# EAGLE design trackuino-shield (EAGLE 6.5.0)
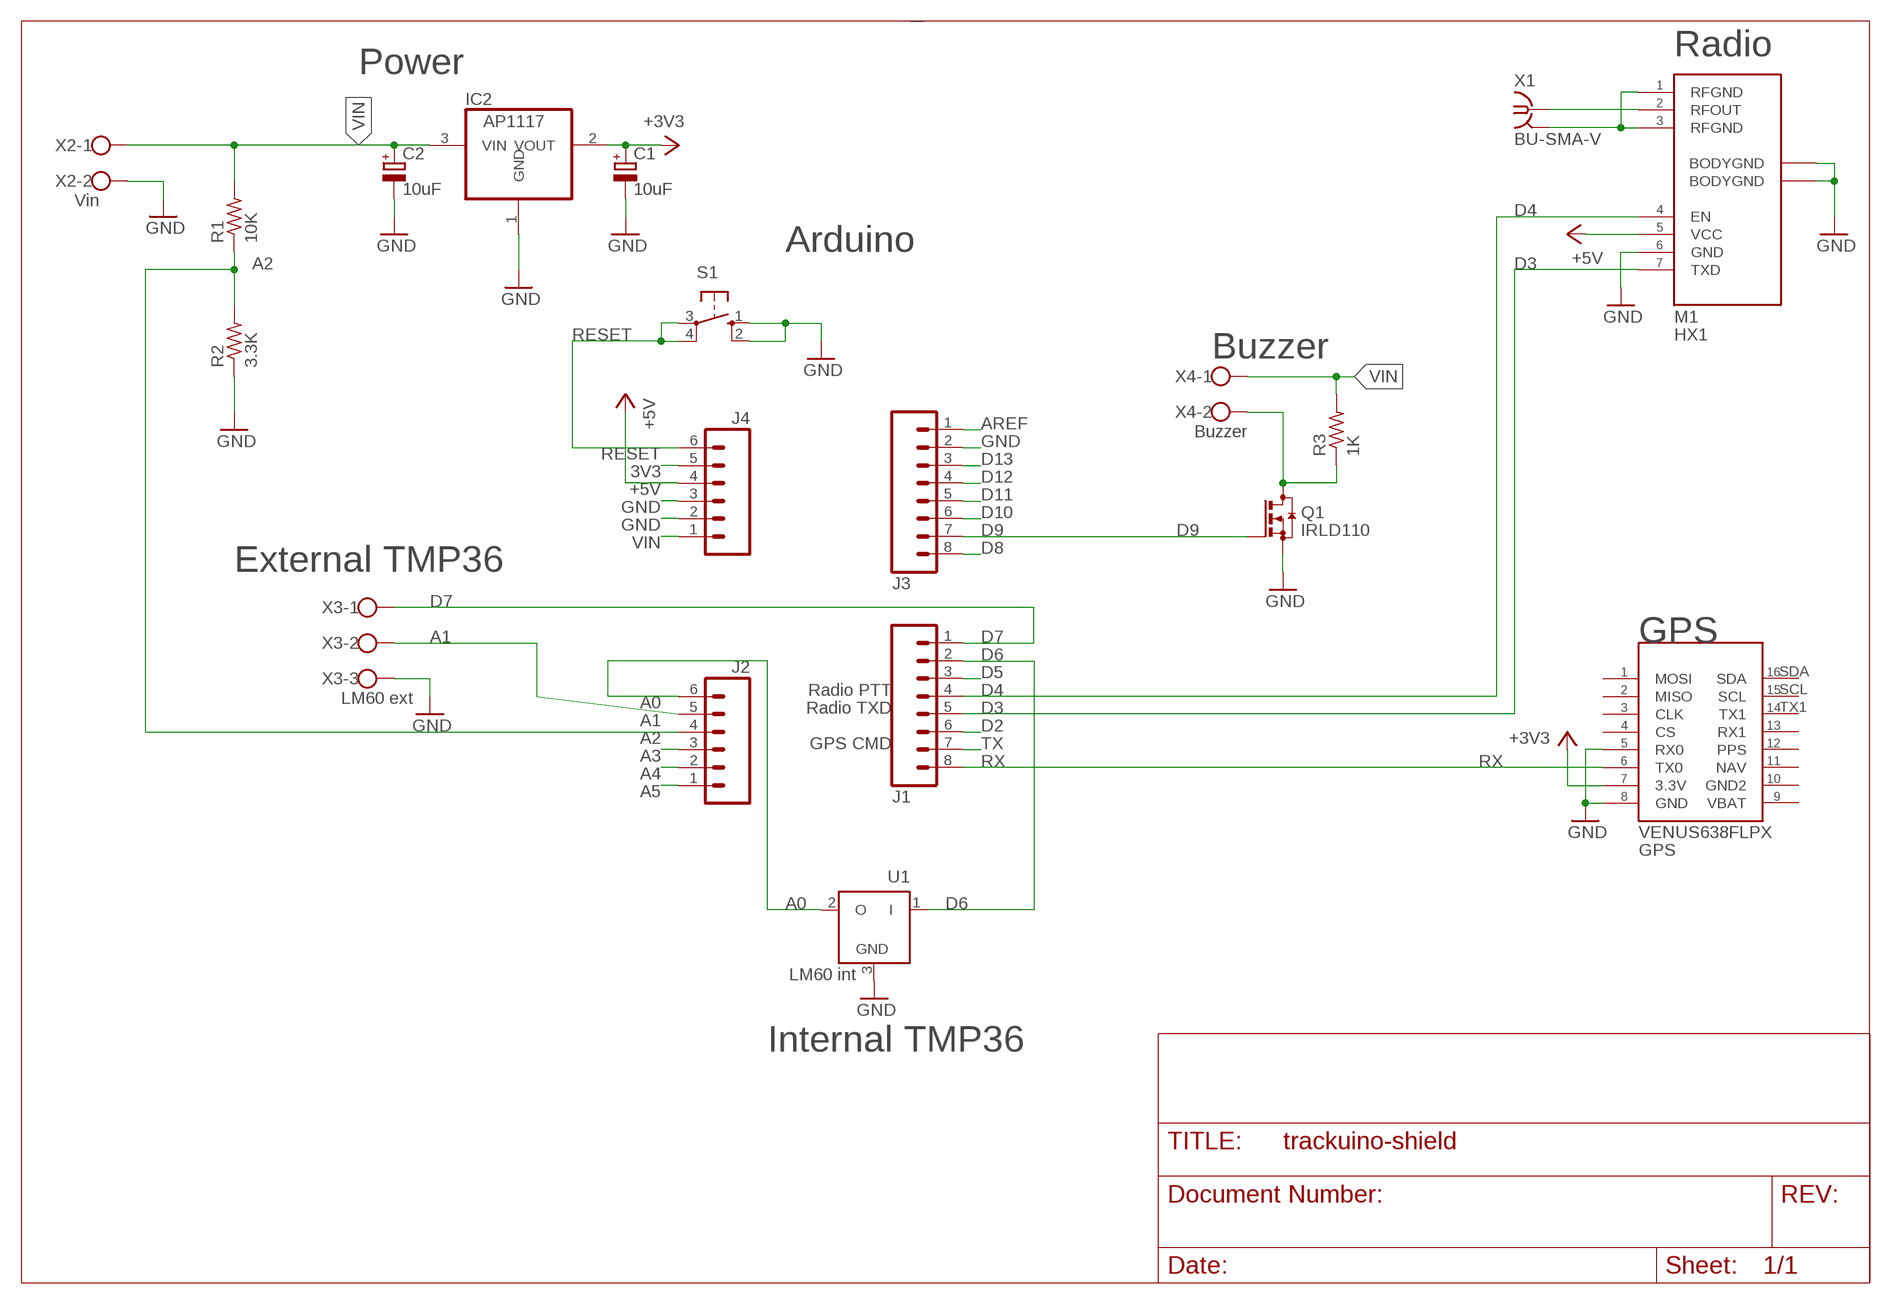
[diagram p0: schematic, sheet 1]

## Parts
C1  10uF  CPOL-EUE2.5-5  [E2,5-5]
C2  10uF  CPOL-EUE2.5-5  [E2,5-5]
GPS  VENUS638FLPX  [VENUS638FLPX]
IC2  AP1117  [TO220-3]
J1  M081X08  [1X08]
J2  M06SIP  [1X06]
J3  M081X08  [1X08]
J4  M06SIP  [1X06]
M1  HX1  [HX1]
Q1  IRLD110  [HVMDIP]
R1  10K  R-US_0207/7  [0207/7]
R2  3.3K  R-US_0207/7  [0207/7]
R3  1K  R-US_0207/7  [0207/7]
S1  10-XX  [B3F-10XX]
U1  LM60 int  LM60  [TO92]
X1  BU-SMA-V  [BU-SMA-V]
X2  Vin  W237-102  [W237-102]
X3  LM60 ext  W237-103  [W237-103]
X4  Buzzer  W237-102  [W237-102]

## Nets
3V3: J4.5
+3V3 [20]: C1.+ GPS.3.3V IC2.2(VOUT)
+5V [20]: J4.4 M1.VCC
A0: J2.6 U1.2(O)
A1: J2.5 X3.2
A2: J2.4 R1.1 R2.2
A3: J2.3
A4: J2.2
A5: J2.1
AREF: J3.1
D2: J1.6
D3: J1.5 M1.TXD
D4: J1.4 M1.EN
D5: J1.3
D6: J1.2 U1.1(I)
D7: J1.1 X3.1
D8: J3.8
D9: J3.7 Q1.G
D10: J3.6
D11: J3.5
D12: J3.4
D13: J3.3
GND: C1.- C2.- GPS.GND GPS.RX0 IC2.1(GND) J3.2 J4.2 J4.3 M1.0V(GND) M1.BODYGND1(BODYGND) M1.BODYGND2(BODYGND) Q1.S R2.1 S1.1(S) S1.2(S1) U1.3(GND) X2.2 X3.3
N$1: Q1.D@1(D) Q1.D@2(D) R3.1 X4.2
N$2: M1.RFOUT X1.1
RESET: J4.6 S1.3(P) S1.4(P1)
RFGND: M1.RFGND1(RFGND) M1.RFGND2(RFGND) X1.2 X1.3 X1.4 X1.5
RX: GPS.TX0 J1.8
TX: J1.7
VIN [30]: C2.+ IC2.3(VIN) J4.1 R1.2 R3.2 X2.1 X4.1
Unconnected: GPS.CLK GPS.CS GPS.GND2 GPS.MISO GPS.MOSI GPS.NAV GPS.PPS GPS.RX1 GPS.SCL GPS.SDA GPS.TX1 GPS.VBAT

## Notes on the sheet
- Radio
- Power
- Arduino
- Buzzer
- External TMP36
- GPS
- Radio PTT
- Radio TXD
- GPS CMD
- Internal TMP36

## Library data of the parts
C1 C2 = rcl:CPOL-EU: POLARIZED CAPACITOR, European symbol
GPS = trackuino:VENUS638FLPX
IC2 = First:AP1117
J1 J3 = SparkFun-Connectors:M08: Header 8 Standard 8-pin 0.1" header. Use with straight break away headers (SKU : PRT-00116), right angle break away headers (PRT-00553), swiss pins (PRT-00743), machine pins (PRT-00117), and female headers (PRT-00115).
J2 J4 = SparkFun-Connectors:M06: Header 6 Standard 6-pin 0.1" header. Use with straight break away headers (SKU : PRT-00116), right angle break away headers (PRT-00553), swiss pins (PRT-00743), machine pins (PRT-00117), and female headers (PRT-00115). Molex polarized connector foot print use with SKU : PRT-08094 with associated crimp pins and housings. NOTES ON THE VARIANTS LOCK and LOCK_LONGPADS... This footprint was designed to help hold the alignment of a through-hole component (i.e. 6-pin header) while soldering it into place. You may notice that each hole has been shifted either up or down by 0.005 of an inch from it's more standard position (which is a perfectly straight line). This slight alteration caused the pins (the squares in the middle) to touch the edges of the holes. Because they are alternating, it causes a "brace" to hold the component in place. 0.005 has proven to be the perfect amount of "off-center" position when using our standard breakaway headers. Although looks a little odd when you look at the bare footprint, once you have a header in there, the alteration is very hard to notice. Also,if you push a header all the way into place, it is covered up entirely on the bottom side. This idea of altering the position of holes to aid alignment will be further integrated into the Sparkfun Library for other footprints. It can help hold any component with 3 or more connection pins.
M1 = trackuino:HX1
Q1 = trackuino:IRLD110
R1-R3 = rcl:R-US_: RESISTOR, American symbol
S1 = switch-omron:10-XX: OMRON SWITCH
U1 = trackuino:LM60
X1 = con-coax:BU-SMA-V: FEMALE SMA CONNECTOR Radiall distributor RS 112-3794; OC_FARNELL: unknown; OC_NEWARK: unknown
X2 X4 = con-wago-500:W237-102: WAGO SCREW CLAMP; MPN: 237-102; OC_FARNELL: unknown; OC_NEWARK: 70K9898
X3 = con-wago-500:W237-103: WAGO SCREW CLAMP; MPN: 237-103; OC_FARNELL: unknown; OC_NEWARK: 18M7116

## Net classes
0 10: width 0.254 mm
1 15: width 0.381 mm
2 20: width 0.508 mm
3 30: width 0.762 mm
4 40: width 1.016 mm
5 50: width 1.27 mm
6 HIGH Current: width 2.54 mm

## Board
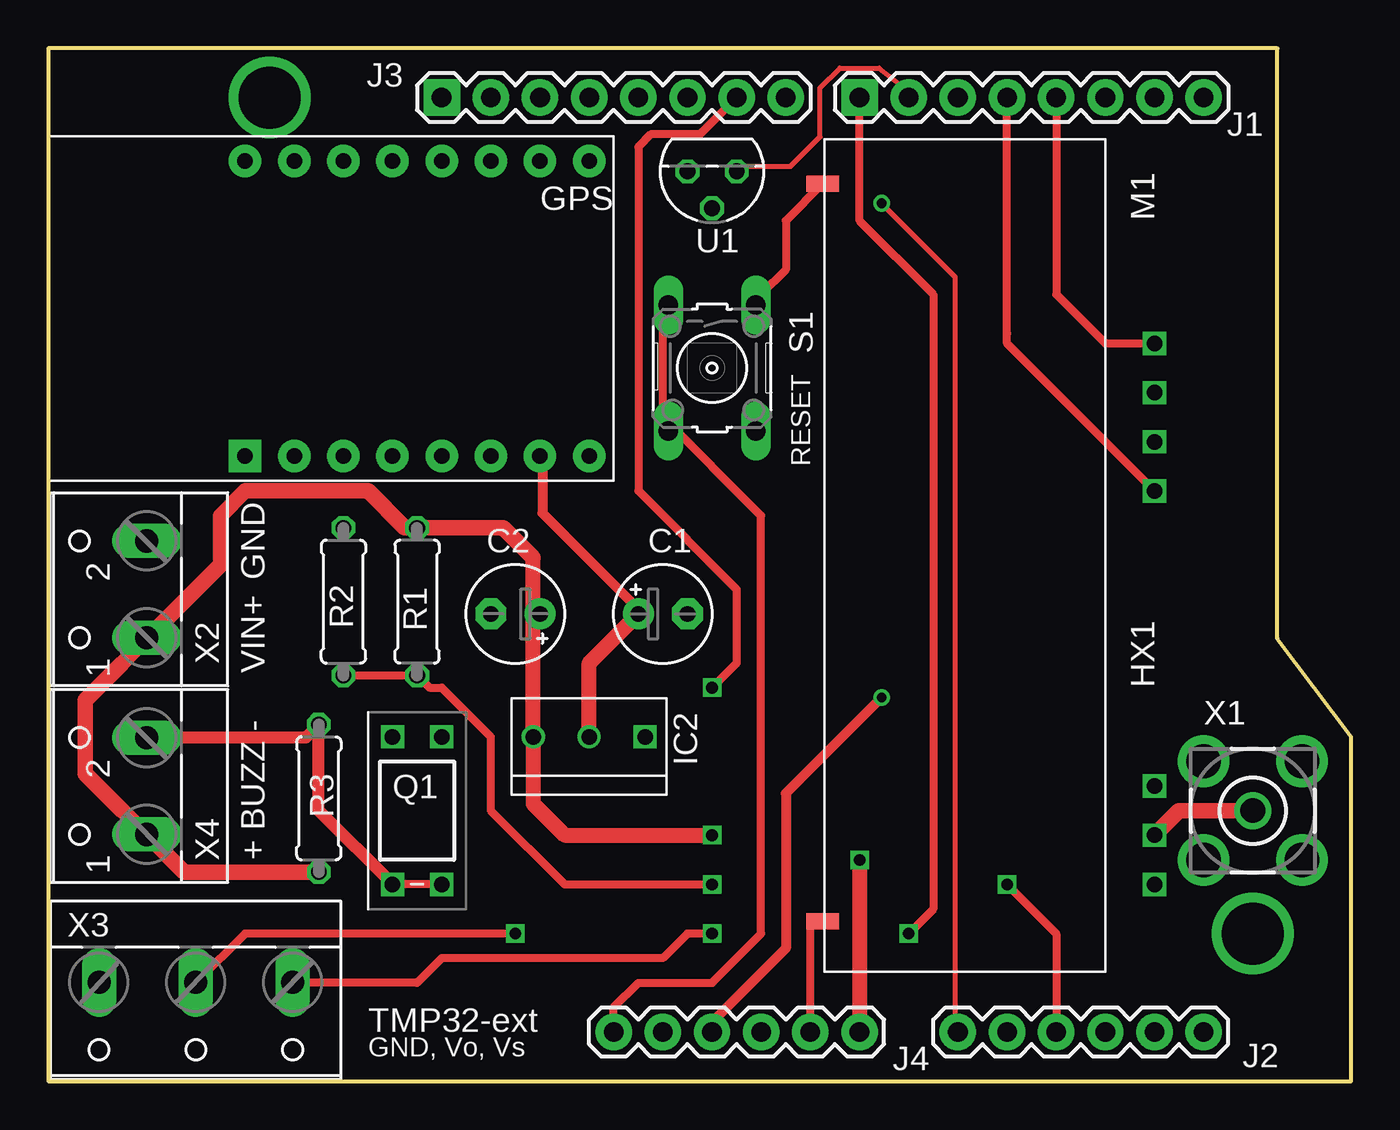
[diagram p1: board, top side]
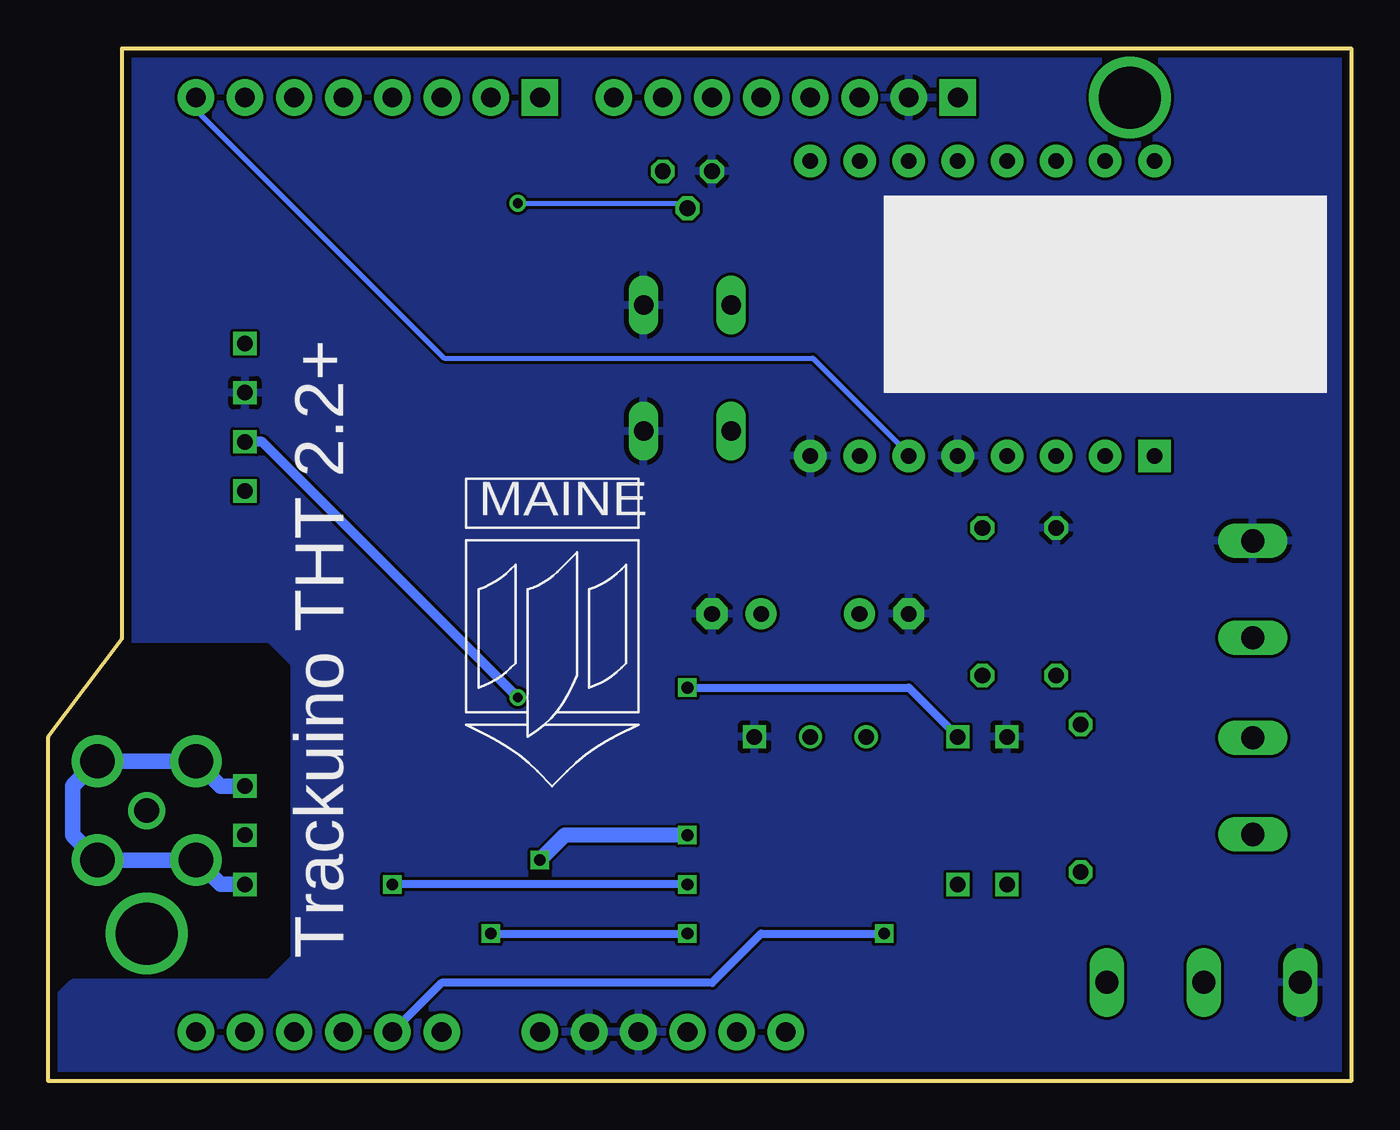
[diagram p2: board, bottom side, seen from below]

Size 67.31 x 53.34 mm. Coordinates in mm from the lower left corner, seen from the top.
Outline: 63.5,53.34 0,53.34 0,0 67.31,0 67.31,17.78 63.5,22.86 63.5,53.34
Copper layers (1*16): Top 0.0356mm / dielectric 1.5011mm / Bottom 0.0356mm
Design rules "LaenPCBOrder": minimum track width 6mil, minimum drill 13mil, track to track 6mil, track to pad 6mil, pad to pad 6mil, via to via 6mil, smd to smd 6mil, copper to edge 15mil, drill to drill 6mil, minimum pad ring 7mil, minimum via ring 7mil, stop-mask expansion 3mil, vias tented up to drill 0mil, thermal gap 10mil

### Footprints (pad centres in the part's own frame; a part is rotated, then mirrored left to right if it is on the bottom)
E2,5-5 = drill 0.813 pad 1.6: + -1.27,0 | drill 0.813 pad 1.6 octagon: - 1.27,0
VENUS638FLPX = drill 0.8 pad 1.676: 3.3V 3.81,16.51; CLK 13.97,16.51; CS 11.43,16.51; GND 1.27,16.51; GND2 3.81,1.27; MISO 16.51,16.51; NAV 6.35,1.27; PPS 8.89,1.27; RX0 8.89,16.51; RX1 11.43,1.27; SCL 16.51,1.27; SDA 19.05,1.27; TX0 6.35,16.51; TX1 13.97,1.27; VBAT 1.27,1.27 | drill 0.8 pad 1.676 square: MOSI 19.05,16.51
TO220-3 = drill 0.8 square: 1 -2.89,0 | drill 0.8: 2 0,0; 3 2.89,0
1X08 = drill 1.016 pad 1.88 square: 1 0,0 | drill 1.016 pad 1.88: 2 2.54,0; 3 5.08,0; 4 7.62,0; 5 10.16,0; 6 12.7,0; 7 15.24,0; 8 17.78,0
1X06 = drill 1.016 pad 1.88: 1 0,0; 2 2.54,0; 3 5.08,0; 4 7.62,0; 5 10.16,0; 6 12.7,0
HX1 = drill 0.8 square: 0V 25.4,-8.89; EN 20.32,-8.89; RFGND1 0,-8.89; RFGND2 5.08,-8.89; RFOUT 2.54,-8.89; TXD 27.94,-8.89; VCC 22.86,-8.89 | smd 0.813 x 1.676: BODYGND1 -1.905,8.255; BODYGND2 36.195,8.255
HVMDIP = drill 0.8 square: D@1 -2.54,0; D@2 0,0; G 0,7.62; S -2.54,7.62
0207/7 = drill 0.813 octagon: 1 -3.81,0; 2 3.81,0
B3F-10XX = drill 1.016 long: 1 -3.251,2.261; 2 3.251,2.261; 3 -3.251,-2.261; 4 3.251,-2.261
TO92 = drill 0.813 octagon: 1 -1.27,0; 2 0,1.905; 3 1.27,0
BU-SMA-V = drill 1.27: 1 0,0 | drill 1.778: 2 -2.55,2.55; 3 2.55,2.55; 4 2.55,-2.55; 5 -2.55,-2.55
W237-102 = drill 1.194 long: 1 -2.5,-1.27; 2 2.5,-1.27
W237-103 = drill 1.194 long: 1 -5,-1.29; 2 0,-1.29; 3 5,-1.29

### Placement (x,y rotation side)
C1  31.75,24.13 0 top
C2  24.13,24.13 180 top
GPS  29.21,48.8 180 top
IC2  27.94,17.78 180 top
J1  41.91,50.8 0 top
J2  59.69,2.54 180 top
J3  20.32,50.8 0 top
J4  41.91,2.54 180 top
M1  48.26,10.16 90 top
Q1  20.32,10.16 0 top
R1  19.05,24.77 90 top
R2  15.24,24.77 270 top
R3  13.97,14.61 270 top
S1  34.29,36.83 270 top
U1  34.29,46.99 180 top
U$1  [FLAGS_SM]  41.27,27.94 0 top
X1  62.23,13.97 0 top
X2  3.81,25.4 90 top
X3  7.62,3.81 180 top
X4  3.81,15.24 90 top

### Tracks (layer width: path | path; a pad name or v marks a point on that pad's centre or on a via)
+3V3
  Top 0.508: 25.15,32.38 GPS.3.3V 25.53,32 25.53,29.34 30.48,24.38 C1.+
  Top 0.762: IC2.2 27.94,21.59 C1.+
+5V  (via drill 0.51)
  Top 0.508: v43.05,19.81 38.1,14.86 38.1,6.86 34.29,3.05 J4.4
  Bottom 0.508: v43.05,19.81 56.26,33.02 M1.VCC
A0  (via drill 0.51)
  Top 0.254: v43.05,45.34 46.86,41.53 46.86,3.05 J2.6
  Bottom 0.254: v43.05,45.34 34.29,45.34 U1.2
A1  (via drill 0.6)
  Top 0.406: v24.13,7.62 10.16,7.62 7.64,5.1 X3.2
  Bottom 0.406: J2.5 46.99,5.08 33.02,5.08 30.48,7.62 v24.13,7.62
A2  (via drill 0.6)
  Top 0.406: R2.2 R1.1 19.68,20.32 20.32,20.32 22.86,17.78 22.86,13.97 26.67,10.16 v34.29,10.16 | v49.53,10.16 52.07,7.62 J2.4
  Bottom 0.406: v34.29,10.16 v49.53,10.16
D3
  Top 0.406: J1.5 52.07,40.64 54.61,38.1 M1.TXD
D4
  Top 0.406: J1.4 49.53,38.61 49.53,38.1 M1.EN
D6
  Top 0.254: J1.2 44.2,51.31 42.93,52.32 40.89,52.32 39.88,51.31 39.88,48.77 38.35,47.24 35.81,47.24 U1.1
D7  (via drill 0.6)
  Top 0.406: J1.1 41.91,44.45 45.72,40.64 45.72,8.89 v44.45,7.62 | v34.29,7.62 33.02,7.62 31.75,6.35 20.32,6.35 19.05,5.08 12.7,5.08 12.64,5.08 X3.1
  Bottom 0.406: v44.45,7.62 v34.29,7.62
D9  (via drill 0.6)
  Top 0.406: J3.7 33.66,48.9 31.11,48.9 30.48,48.26 30.48,30.48 35.56,25.4 35.56,21.59 v34.29,20.32
  Bottom 0.406: v34.29,20.32 22.86,20.32 Q1.G
GND
  Top 0.406: M1.BODYGND2 38.1,44.45 38.1,41.91 36.83,40.64 36.83,40.36 S1.1 | J4.2 39.37,8.26 M1.BODYGND1
  pour Bottom: 0,53.34 63.5,53.34 63.5,22.86 55.88,22.86 54.61,21.59 54.61,6.35 55.88,5.08 66.04,5.08 67.31,3.81 67.31,1.27 66.04,0 0,0
N$1
  Top 0.406: Q1.D@2 Q1.D@1
  Top 0.61: X4.2 13.29,17.74 R3.1 13.97,13.97 Q1.D@1
N$2
  Top 0.813: M1.RFOUT 58.42,13.97 X1.1
N$3  (via drill 3.2)
  other vias: 62.23,7.62
N$4  (via drill 3.2)
  other vias: 11.43,50.8
RESET
  Top 0.406: J4.6 29.21,3.81 30.48,5.08 34.29,5.08 36.83,7.62 36.83,29.21 31.75,34.29 | 31.75,34.29 31.75,39.8 S1.3 | 31.75,34.29 31.75,33.86 S1.4
RFGND
  Bottom 0.813: M1.RFGND1 58.42,10.16 X1.5 X1.4 64.78,11.44 66.04,12.7 66.04,15.26 X1.3 X1.2 58.4,15.24 M1.RFGND2
RX
  Bottom 0.254: GPS.TX0 22.86,32.38 27.81,37.34 46.86,37.34 59.44,49.91 59.44,50.67 J1.8
VIN  (via drill 0.6)
  Top 0.762: 25.05,23.78 IC2.3 25.05,14.32 26.67,12.7 v34.29,12.7 | 25.05,23.78 C2.+ | 25.05,23.78 25.05,27.02 | v41.91,11.43 J4.1
  Top 0.813: R3.2 7.03,10.79 X4.1 3.85,13.97 3.81,13.97 1.91,15.88 1.91,19.68 3.81,21.59 X2.1 5.12,22.9 8.89,26.67 8.89,29.21 10.16,30.48 16.51,30.48 18.41,28.57 R1.2 23.5,28.57 25.05,27.02
  Bottom 0.762: v34.29,12.7 40.64,12.7 v41.91,11.43

### Text on the board
tNames: RESET | GND | VIN+ | + BUZZ - | TMP32-ext | GND, Vo, Vs
bNames: Trackuino THT 2.2+
Document: 3.3V: bridge J7; buffers on IC3, IC5 | 5V: bridge J6, J8; buffer on IC4 | http://trackuino.org